# Altium schematic sheet MAIN_250314.schdoc
size A3; Date: 2025-4-19; DrawnBy: 曹子建; Time: 2025-4-19
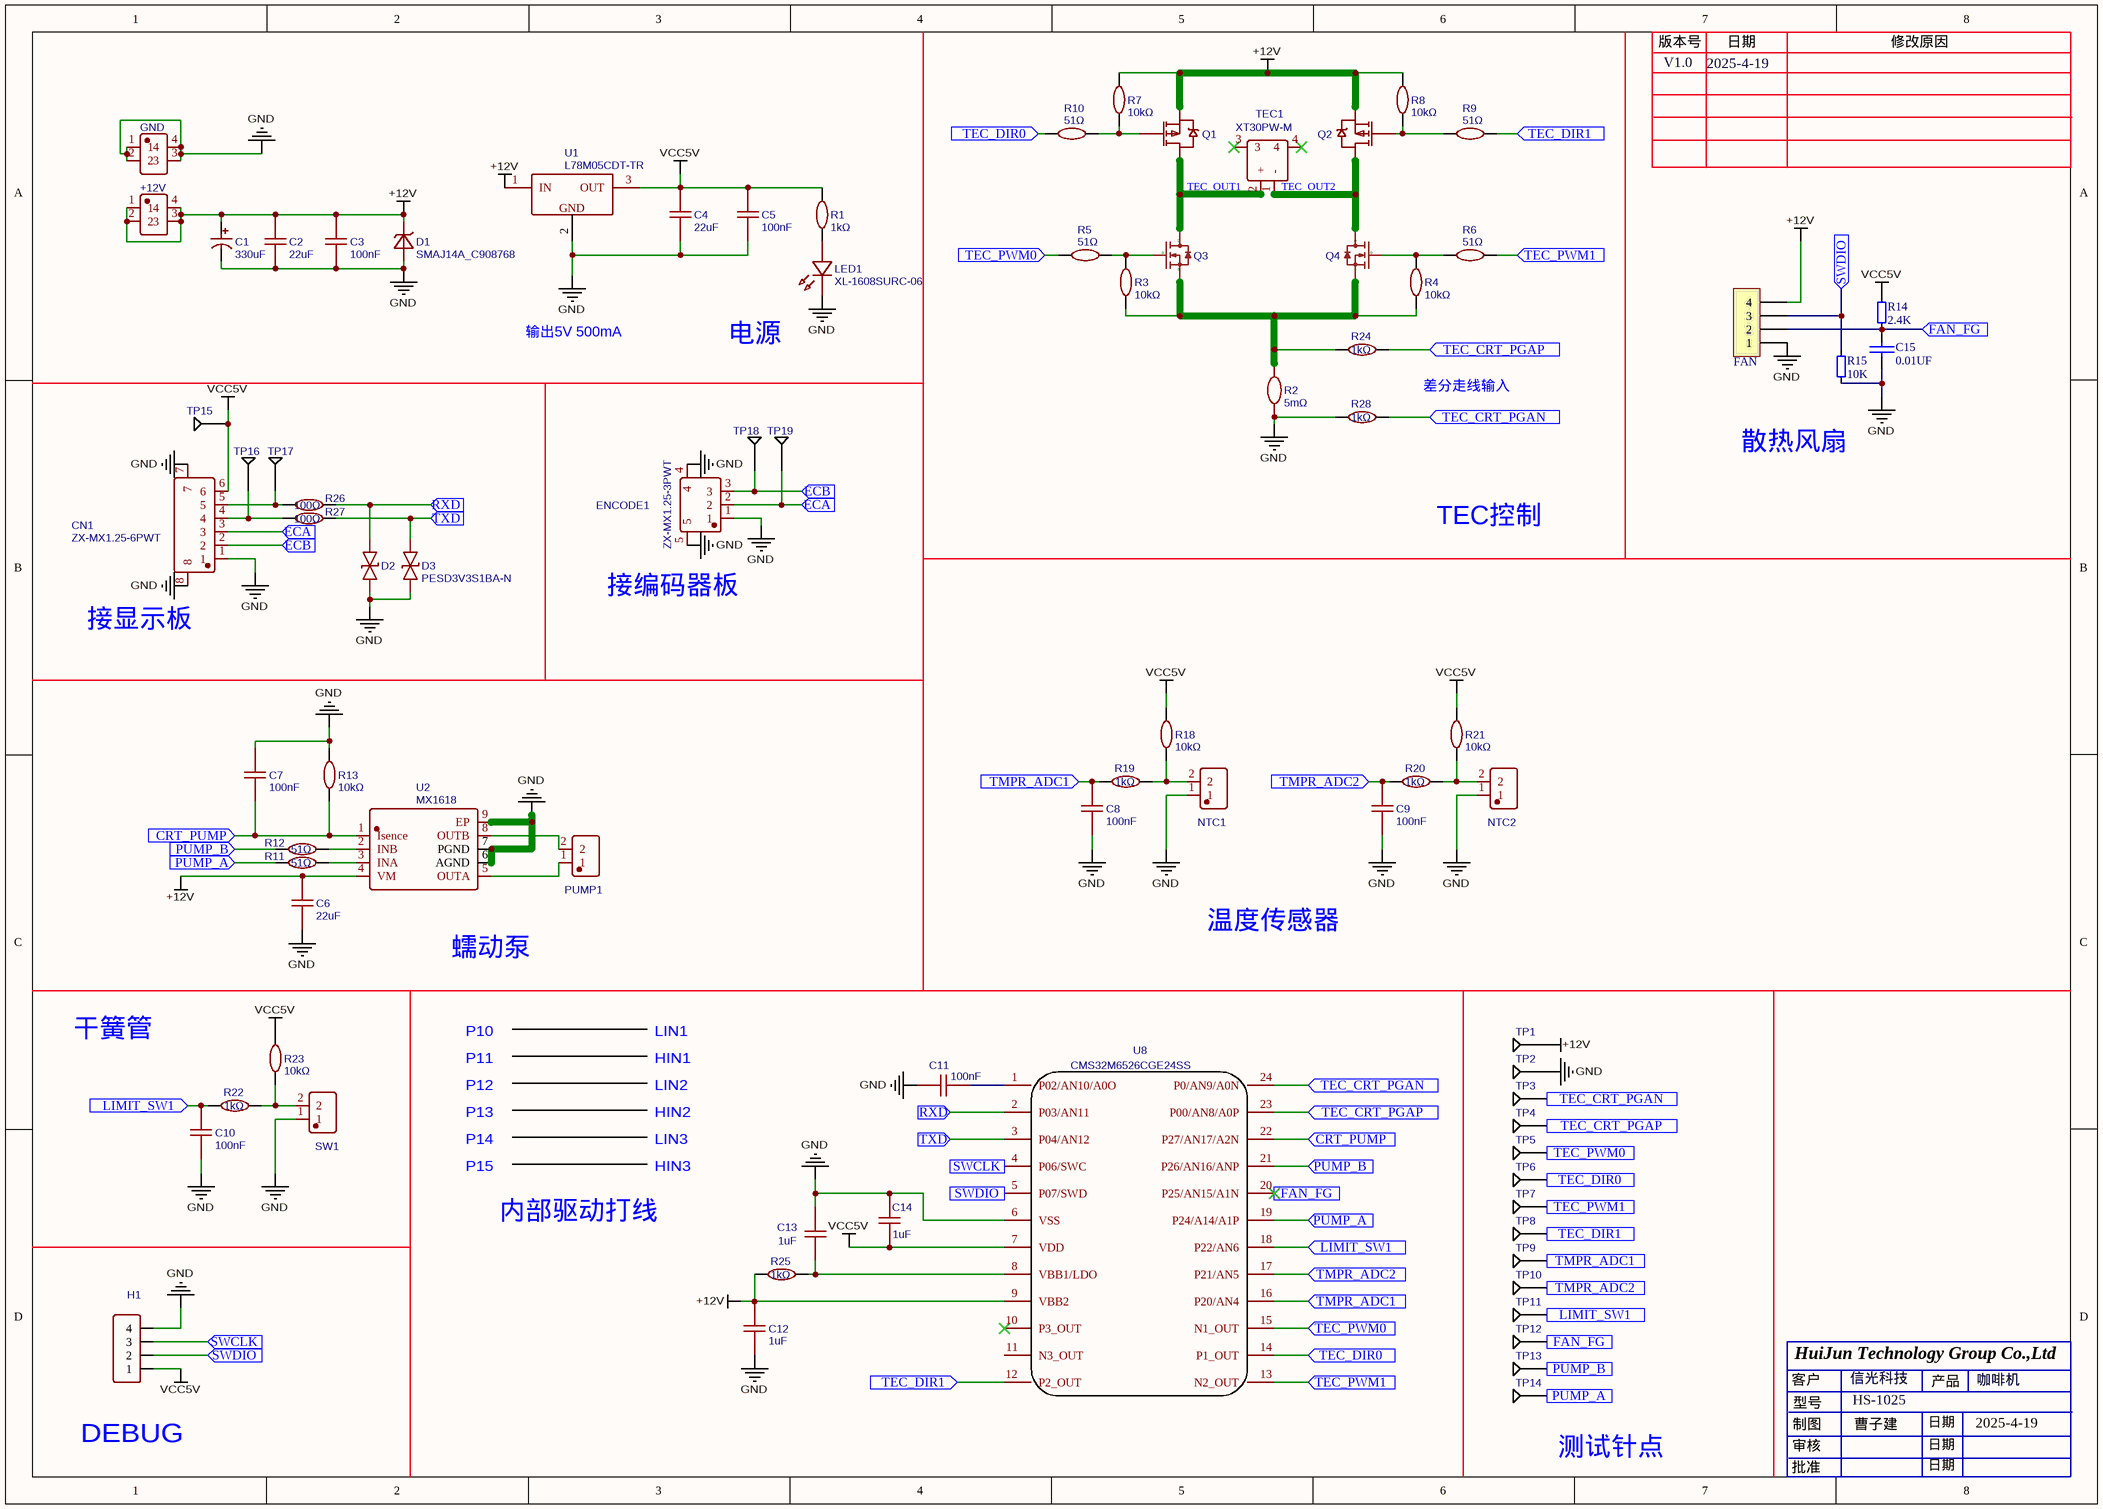
[diagram p0: MAIN_250314.schdoc]

## Parts
+12V  T34080080-0680  [CONN-TH_T34080080-0680]  (value not drawn)
C1  330uF  [CAP-TH_BD8.0-P3.50-D0.6-FD]
C2  22uF  [C0805]
C3  100nF  [C0603]
C4  22uF  [C0805]
C5  100nF  [C0603]
C6  22uF  [C0805]
C7  100nF  [C0603]
C8  100nF  [C0603]
C9  100nF  [C0603]
C10  100nF  [C0603]
C11  100nF  [C0603]
C12  1uF  [C0603]
C13  1uF  [C0603]
C14  1uF  [C0603]
C15  0.01UF  [C0603]
CN1  ZX-MX1.25-6PWT  [CONN-SMD_6P-P1.25_MEGASTAR_ZX-MX1.25-6PWT]
D1  SMAJ14A_C908768  [SMA_L4.3-W2.6-LS5.1-RD]
D2  PESD3V3S1BA-N  [SOD-523_L1.2-W0.8-LS1.6-BI]  (value not drawn)
D3  PESD3V3S1BA-N  [SOD-523_L1.2-W0.8-LS1.6-BI]
ENCODE1  ZX-MX1.25-3PWT  [CONN-SMD_3P-P1.25_MEGASTAR_ZX-MX1.25-3PWT]
FAN  CON4  [CONN-SMD_4P-P1.50_HC-ZH-4PW]  (value not drawn)
GND  T34080080-0680  [CONN-TH_T34080080-0680]  (value not drawn)
H1  HDR-F-2.54_1x4  [HDR-F-2.54_1X4]  (value not drawn)
LED1  XL-1608SURC-06  [LED0603-RD_RED]
NTC1  XY-XHB2.54-2A21  [HDR-TH_2P-P2.50-H-F-W7.3-N]  (value not drawn)
NTC2  XY-XHB2.54-2A21  [HDR-TH_2P-P2.50-H-F-W7.3-N]  (value not drawn)
PUMP1  XY-XHB2.54-2A21  [HDR-TH_2P-P2.50-H-F-W7.3-N]  (value not drawn)
Q1  HY19P03D  [TO-252-2_L6.6-W6.1-P4.57-LS9.9-TL-CW]  (value not drawn)
Q2  HY19P03D  [TO-252-2_L6.6-W6.1-P4.57-LS9.9-TL-CW]  (value not drawn)
Q3  MDD50N03D  [TO-252-2_L6.6-W6.1-P4.57-LS9.9-BR-CW]  (value not drawn)
Q4  MDD50N03D  [TO-252-2_L6.6-W6.1-P4.57-LS9.9-BR-CW]  (value not drawn)
R1  1kΩ  [R0603]
R2  5mΩ  [RES-SMD_L6.4-W3.2-1]
R3  10kΩ  [R0603]
R4  10kΩ  [R0603]
R5  51Ω  [R0603]
R6  51Ω  [R0603]
R7  10kΩ  [R0603]
R8  10kΩ  [R0603]
R9  51Ω  [R0603]
R10  51Ω  [R0603]
R11  51Ω  [R0603]
R12  51Ω  [R0603]
R13  10kΩ  [R0603]
R14  2.4K  [R0603]
R15  10K  [R0603]
R18  10kΩ  [R0603]
R19  1kΩ  [R0603]
R20  1kΩ  [R0603]
R21  10kΩ  [R0603]
R22  1kΩ  [R0603]
R23  10kΩ  [R0603]
R24  1kΩ  [R0603]
R25  1kΩ  [R0603]
R26  100Ω  [R0603]
R27  100Ω  [R0603]
R28  1kΩ  [R0603]
SW1  XY-XHB2.54-2A21  [HDR-TH_2P-P2.50-H-F-W7.3-N]  (value not drawn)
TEC1  XT30PW-M  [CONN-TH_XT30PW-M]
TP1  TP-1.5MM  [TP_1.5MM]  (value not drawn)
TP2  TP-1.5MM  [TP_1.5MM]  (value not drawn)
TP3  TP-1.5MM  [TP_1.5MM]  (value not drawn)
TP4  TP-1.5MM  [TP_1.5MM]  (value not drawn)
TP5  TP-1.5MM  [TP_1.5MM]  (value not drawn)
TP6  TP-1.5MM  [TP_1.5MM]  (value not drawn)
TP7  TP-1.5MM  [TP_1.5MM]  (value not drawn)
TP8  TP-1.5MM  [TP_1.5MM]  (value not drawn)
TP9  TP-1.5MM  [TP_1.5MM]  (value not drawn)
TP10  TP-1.5MM  [TP_1.5MM]  (value not drawn)
TP11  TP-1.5MM  [TP_1.5MM]  (value not drawn)
TP12  TP-1.5MM  [TP_1.5MM]  (value not drawn)
TP13  TP-1.5MM  [TP_1.5MM]  (value not drawn)
TP14  TP-1.5MM  [TP_1.5MM]  (value not drawn)
TP15  TP-1.5MM  [TP_1.5MM]  (value not drawn)
TP16  TP-1.5MM  [TP_1.5MM]  (value not drawn)
TP17  TP-1.5MM  [TP_1.5MM]  (value not drawn)
TP18  TP-1.5MM  [TP_1.5MM]  (value not drawn)
TP19  TP-1.5MM  [TP_1.5MM]  (value not drawn)
U1  L78M05CDT-TR  [TO-252-3_L6.5-W5.8-P4.58-BL]
U2  MX1618  [ESOP-8_L4.9-W3.9-P1.27-LS6.0-BL-EP]
U8  CMS32M6526CGE24SS  [SSOP24-0.635-8.65X4MM]

## Ports
CRT_PUMP (in), ECA (in), ECB (in), FAN_FG (in), LIMIT_SW1 (in), PUMP_A (in), PUMP_B (in), RXD (in), SWCLK (in), SWDIO (in), TEC_CRT_PGAN (in), TEC_CRT_PGAP (in), TEC_DIR0 (in), TEC_DIR1 (in), TEC_PWM0 (in), TEC_PWM1 (in), TMPR_ADC1 (in), TMPR_ADC2 (in), TXD (in)

## Nets
+12V: +12V.1 +12V.2 +12V.3 +12V.4 C1.1 C2.2 C3.2 C6.2 C12.2 D1.1 FAN.4 Q1.3(S) Q2.3(S) R7.1 R8.1 R25.1 TP1.1 U1.1(IN) U2.4(VM) U8.9(VBB2)
GND: C1.2 C2.1 C3.1 C4.1 C5.1 C6.1 C7.2 C8.1 C9.1 C10.1 C11.2 C12.1 C13.1 C14.1 C15.2 CN1.1 CN1.7 CN1.8 D1.2 D2.1 D3.1 ENCODE1.1 ENCODE1.4 ENCODE1.5 FAN.1 GND.1 GND.2 GND.3 GND.4 H1.4 LED1.1(K) NTC1.1 NTC2.1 R2.1 R13.2 R15.1 R28.1 SW1.1 TP2.1 U1.2(GND) U2.6(AGND) U2.7(PGND) U2.9(EP) U8.6(VSS)
VCC5V: C4.2 C5.2 C14.2 CN1.6 H1.1 R1.1 R14.1 R18.2 R21.2 R23.2 TP15.1 U1.3(OUT) U8.7(VDD)
CRT_PUMP: C7.1 R13.1 U2.1(Isence) U8.22(P27/AN17/A2N) ; port CRT_PUMP
ECA: CN1.3 ENCODE1.2 TP19.1 ; port ECA
ECB: CN1.2 ENCODE1.3 TP18.1 ; port ECB
FAN_FG: C15.1 FAN.2 R14.2 TP12.1 U8.20(P25/AN15/A1N) ; port FAN_FG
LIMIT_SW1: C10.2 R22.1 TP11.1 U8.18(P22/AN6) ; port LIMIT_SW1
PUMP_A: R11.1 TP14.1 U8.19(P24/A14/A1P) ; port PUMP_A
PUMP_B: R12.1 TP13.1 U8.21(P26/AN16/ANP) ; port PUMP_B
RXD: D2.2 R26.2 U8.2(P03/AN11) ; port RXD
SWCLK: H1.3 U8.4(P06/SWC) ; port SWCLK
SWDIO: FAN.3 H1.2 R15.2 U8.5(P07/SWD) ; port SWDIO
TEC_CRT_PGAN: R28.2 TP3.1 U8.24(P0/AN9/A0N) ; port TEC_CRT_PGAN
TEC_CRT_PGAP: R24.2 TP4.1 U8.23(P00/AN8/A0P) ; port TEC_CRT_PGAP
TEC_DIR0: R10.1 TP6.1 U8.14(P1_OUT) ; port TEC_DIR0
TEC_DIR1: R9.2 TP8.1 U8.12(P2_OUT) ; port TEC_DIR1
TEC_OUT1: Q1.2(D) Q3.2(D) TEC1.2(+)
TEC_OUT2: Q2.2(D) Q4.2(D) TEC1.1(-)
TEC_PWM0: R5.1 TP5.1 U8.15(N1_OUT) ; port TEC_PWM0
TEC_PWM1: R6.2 TP7.1 U8.13(N2_OUT) ; port TEC_PWM1
TMPR_ADC1: C8.2 R19.1 TP9.1 U8.16(P20/AN4) ; port TMPR_ADC1
TMPR_ADC2: C9.2 R20.1 TP10.1 U8.17(P21/AN5) ; port TMPR_ADC2
TXD: D3.2 R27.2 U8.3(P04/AN12) ; port TXD
NetC11_1: C11.1 U8.1(P02/AN10/A0O)
NetC13_2: C13.2 R25.2 U8.8(VBB1/LDO)
NetCN1_4: CN1.4 R27.1 TP16.1
NetCN1_5: CN1.5 R26.1 TP17.1
NetLED1_2: LED1.2(A) R1.2
NetNTC1_2: NTC1.2 R18.1 R19.2
NetNTC2_2: NTC2.2 R20.2 R21.1
NetPUMP1_1: PUMP1.1 U2.5(OUTA)
NetPUMP1_2: PUMP1.2 U2.8(OUTB)
NetQ1_1: Q1.1(G) R7.2 R10.2
NetQ2_1: Q2.1(G) R8.2 R9.1
NetQ3_1: Q3.1(G) R3.2 R5.2
NetQ3_3: Q3.3(S) Q4.3(S) R2.2 R3.1 R4.1 R24.1
NetQ4_1: Q4.1(G) R4.2 R6.1
NetR11_2: R11.2 U2.3(INA)
NetR12_2: R12.2 U2.2(INB)
NetR22_2: R22.2 R23.1 SW1.2

Not connected (* = marked no-connect by the designer): TEC1 3* 4*; U8 10(P3_OUT)* 11(N3_OUT)

## Notes on the sheet
- 输出5V 500mA
- 电源
- 差分走线输入
- 散热风扇
- TEC控制
- 接显示板
- (near ENCODE1) 接编码器板
- 蠕动泵
- 温度传感器
- 干簧管
- P10
- LIN1
- P11
- P12
- P13
- HIN1
- LIN2
- HIN2
- P14
- P15
- LIN3
- HIN3
- 内部驱动打线
- 信光科技
- 咖啡机
- (near H1) DEBUG
- 测试针点
- HS-1025
- 版本号
- 日期
- 修改原因
- V1.0
- 客户
- HuiJun Technology Group Co.,Ltd
- 产品
- 审核
- 制图
- 型号
- 批准

## Library data of the parts
+12V GND = T34080080-0680: Manufacturer: XFCN(兴飞); Contributor: lcsc; Supplier: LCSC; Supplier Part: C19724524; Manufacturer Part: T34080080-0680; JLCPCB Part Class: Extended Part; spicePre: U; spiceSymbolName: T34080080-0680
C1 = 330uF: Manufacturer: rubycon(红宝石); Manufacturer Part: 25ZLH330MEFC8X11.5; nameAlias: Value; Supplier: LCSC; Supplier Part: C109394; JLCPCB Part Class: Extended Part; spicePre: C; spiceSymbolName: 25ZLH330MEFC8X11.5
C2 C4 C6 = 22uF: Manufacturer: SAMSUNG(三星); Manufacturer Part: CL21A226MAYNNNE; nameAlias: Value; Contributor: LCSC; Supplier: LCSC; Supplier Part: C602037; JLCPCB Part Class: Extended Part; spicePre: C; spiceSymbolName: CL21A226MAYNNNE
C3 C5 C7-C11 = 100nF: Manufacturer: SAMSUNG(三星); Manufacturer Part: CL10B104KB8NNNC; nameAlias: Value; Supplier: LCSC; Supplier Part: C1591; JLCPCB Part Class: Extended Part; spicePre: C; spiceSymbolName: CL10B104KB8NNNC
C12-C14 = 1uF: Manufacturer: YAGEO(国巨); Manufacturer Part: CC0603KRX7R9BB105; nameAlias: Value; Contributor: LCSC; Supplier: LCSC; Supplier Part: C559769; JLCPCB Part Class: Extended Part; spicePre: C; spiceSymbolName: CC0603KRX7R9BB105
C15 = CAP: Capacitor; 规格型号: 104-50V-J-X7R-0805; 品名: 贴片电容
CN1 = ZX-MX1.25-6PWT: Manufacturer: Megastar(兆星); Contributor: lcsc; Supplier: LCSC; Supplier Part: C7430472; Manufacturer Part: ZX-MX1.25-6PWT; JLCPCB Part Class: Extended Part; spicePre: U; spiceSymbolName: ZX-MX1.25-6PWT
D1 = SMAJ14A_C908768: Manufacturer: GOODWORK(固得沃克); Contributor: LCSC; Supplier: LCSC; Supplier Part: C908768; Manufacturer Part: SMAJ14A; JLCPCB Part Class: Extended Part; spicePre: D; spiceSymbolName: SMAJ14A_C908768
D2 D3 = PESD3V3S1BA-N: Manufacturer: BORN(伯恩半导体); Contributor: LCSC; Supplier: LCSC; Supplier Part: C316037; Manufacturer Part: PESD3V3S1BA-N; JLCPCB Part Class: Extended Part; spicePre: D; spiceSymbolName: PESD3V3S1BA-N
ENCODE1 = ZX-MX1.25-3PWT: Manufacturer: Megastar(兆星); Contributor: lcsc; Supplier: LCSC; Supplier Part: C7430469; Manufacturer Part: ZX-MX1.25-3PWT; JLCPCB Part Class: Extended Part; spicePre: U; spiceSymbolName: ZX-MX1.25-3PWT
FAN = CON4: Connector
H1 = HDR-F-2.54_1x4: Contributor: LCEDA_Lib; Supplier Part: C225501; Supplier: LCSC; spicePre: H; spiceSymbolName: HDR-F-2.54_1x4
LED1 = XL-1608SURC-06: Manufacturer: XINGLIGHT(成兴光); Contributor: LCSC; Supplier: LCSC; Supplier Part: C965799; Manufacturer Part: XL-1608SURC-06; JLCPCB Part Class: Extended Part; spicePre: L; spiceSymbolName: XL-1608SURC-06
NTC1 NTC2 PUMP1 SW1 = XY-XHB2.54-2A21: Manufacturer: XYECONN(辛译); Contributor: lcsc; Supplier: LCSC; Supplier Part: C19271395; Manufacturer Part: XY-XHB2.54-2A21; JLCPCB Part Class: Extended Part; spicePre: U; spiceSymbolName: XY-XHB2.54-2A21
Q1 Q2 = HY19P03D: Manufacturer: HUAYI(华羿微); Supplier: LCSC; Manufacturer Part: HY19P03D; Supplier Part: C122492; JLCPCB Part Class: Extended Part; spicePre: Q; spiceSymbolName: HY19P03D
Q3 Q4 = MDD50N03D: Manufacturer: MDD(辰达半导体); Contributor: lcsc; Supplier: LCSC; Supplier Part: C5357578; Manufacturer Part: MDD50N03D; JLCPCB Part Class: Extended Part; spicePre: Q; spiceSymbolName: MDD50N03D
R1 = 1kΩ: Manufacturer Part: RC0603FR-071KL; Manufacturer: YAGEO(国巨); nameAlias: Value; Supplier: LCSC; Supplier Part: C22548; JLCPCB Part Class: Extended Part; spicePre: R; spiceSymbolName: RC0603FR-071KL
R2 = 5mΩ: Manufacturer: Milliohm(毫欧); Manufacturer Part: HoJLR2512-3W-5mR-1%; nameAlias: Value; Contributor: LCSC; Supplier: LCSC; Supplier Part: C2903482; JLCPCB Part Class: Extended Part; spicePre: R; spiceSymbolName: HOJLR2512-3W-5MR-1%
R3 R4 R7 R8 R13 R18 R21 R23 = 10kΩ: Manufacturer: UNI-ROYAL(厚声); Manufacturer Part: 0603WAF1002T5E; nameAlias: Value; Supplier: LCSC; Supplier Part: C25804; JLCPCB Part Class: Basic Part; spicePre: R; spiceSymbolName: 0603WAF1002T5E
R5 R6 R9-R12 = 51Ω: Manufacturer: UNI-ROYAL(厚声); Manufacturer Part: 0603WAF100JT5E; nameAlias: Value; Supplier: LCSC; Supplier Part: C22859; JLCPCB Part Class: Basic Part; spicePre: R; spiceSymbolName: 0603WAF100JT5E
R14 R15 = RES-SMD: 规格型号: 1K-J-0805; 品名: 贴片电阻
R19 R20 R22 R24 R25 R28 = 1kΩ: Manufacturer: UNI-ROYAL(厚声); Manufacturer Part: 0603WAF1001T5E; nameAlias: Value; Supplier: LCSC; Supplier Part: C21190; JLCPCB Part Class: Basic Part; spicePre: R; spiceSymbolName: 0603WAF1001T5E
R26 R27 = 100Ω: Manufacturer: UNI-ROYAL(厚声); Manufacturer Part: 0603WAF1000T5E; nameAlias: Value; Supplier: LCSC; Supplier Part: C22775; JLCPCB Part Class: Basic Part; spicePre: R; spiceSymbolName: 0603WAF1000T5E
TEC1 = XT30PW-M: Manufacturer: AMASS(艾迈斯); Manufacturer Part: XT30PW-M30.G.Y; Contributor: LCSC; Supplier: LCSC; Supplier Part: C431092; JLCPCB Part Class: Extended Part; spicePre: C; spiceSymbolName: XT30PW-M
TP1-TP19 = TP-1.5MM: Manufacturer: 盈帜; Manufacturer Part: TP; Contributor: mmn128; Supplier Part: TP; spicePre: P; spiceSymbolName: TP-1.5MM
U1 = L78M05CDT-TR: Manufacturer: ST(意法半导体); Supplier: LCSC; Manufacturer Part: L78M05CDT-TR; Supplier Part: C55509; JLCPCB Part Class: Extended Part; spicePre: U; spiceSymbolName: L78M05CDT-TR
U2 = MX1618: Manufacturer: Mixic(中科芯亿达); Contributor: lcsc; Supplier: LCSC; Supplier Part: C5119048; Manufacturer Part: MX1618; JLCPCB Part Class: Extended Part; spicePre: U; spiceSymbolName: MX1618
U8 = CMS32M6526CGE24SS: Contributor: mbb1234; spicePre: U; spiceSymbolName: CMS32M6526CGE24SS